# Altium schematic sheet OpenRex_V1I1 Project.SchDoc
size A3; DocumentNumber: 31; SheetNumber: 31; SheetTotal: 31; PageSetup: Record=PageOptions|CenterHorizontal=True|CenterVertical=True|PrintScale=1.07|XCorrection=1.00|YCorrection=1.00|PrintKind=1|BorderSize=5000000|LeftOffset=0|BottomOffset=0|Orientation=2|PaperLength=1000|PaperWidth=1000|Scale=100|PaperSource=7|PrintQuality=600|MediaType=1|DitherType=10|PaperKind=A3|PrintScaleMode=1
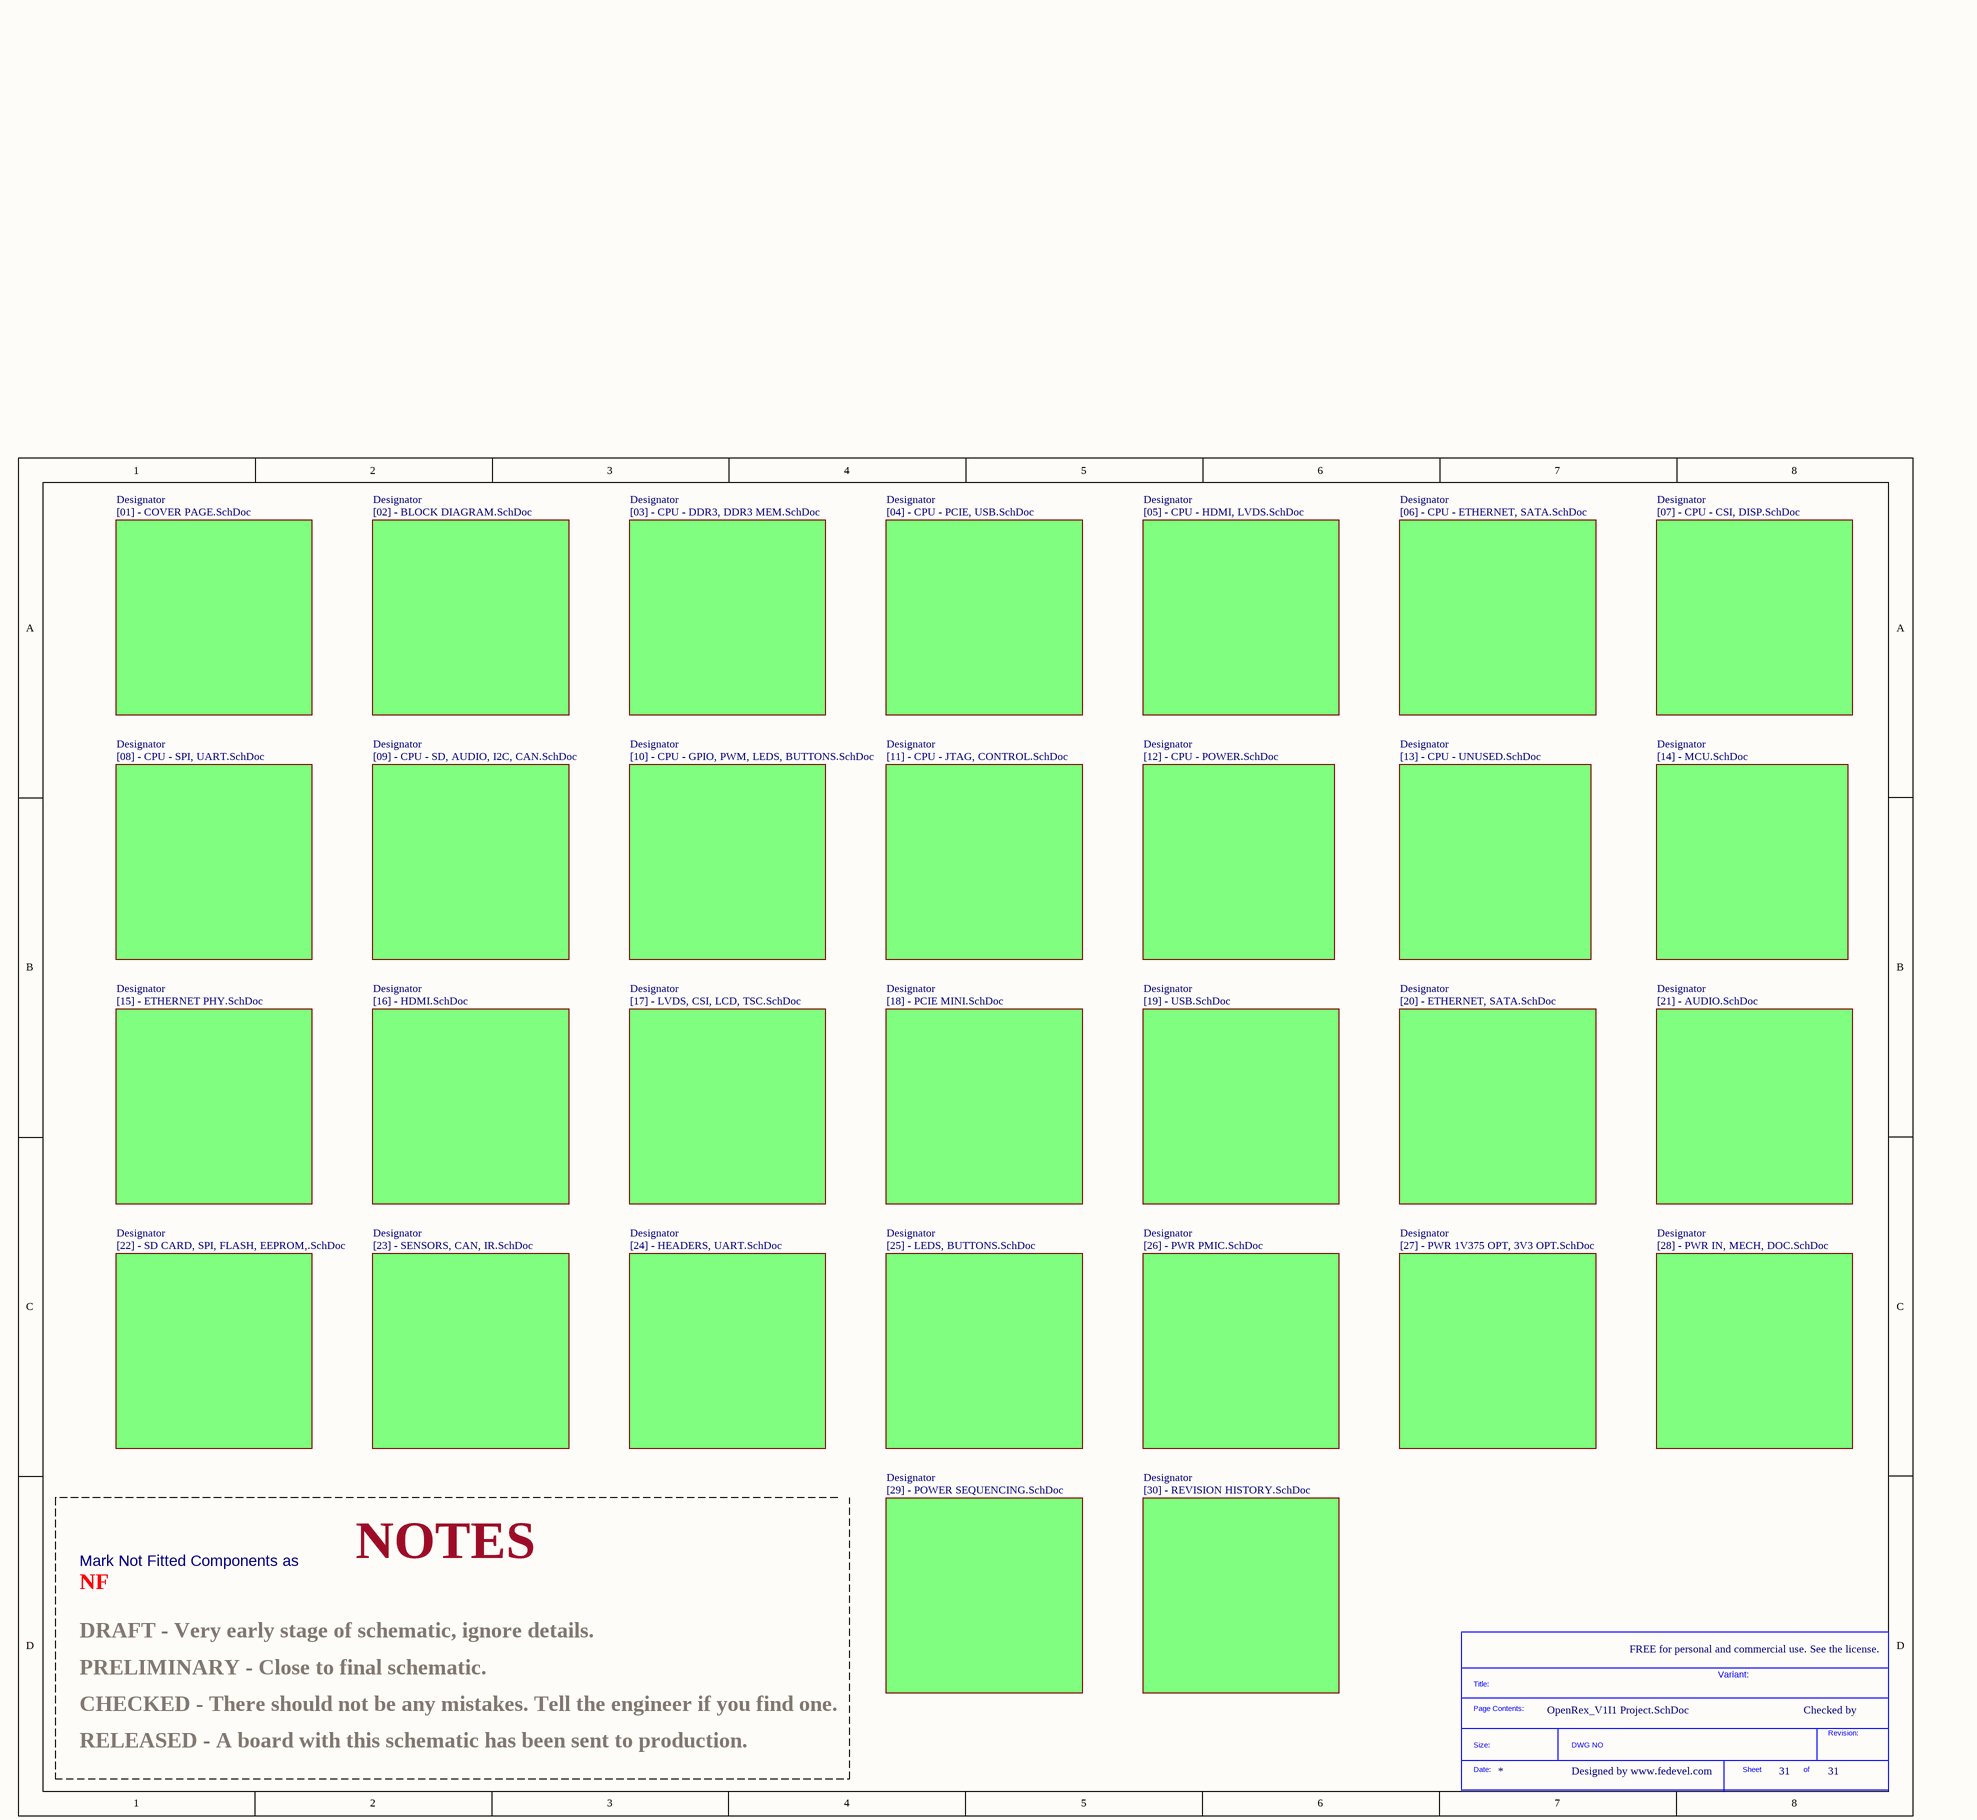
[diagram p0: OpenRex_V1I1 Project.SchDoc]

## Parts
*  SDTitleBlock  (value not drawn)  (graphical)

## Sub-sheets
Designator = [01] - COVER PAGE.SchDoc: no entries
Designator = [02] - BLOCK DIAGRAM.SchDoc: no entries
Designator = [17] - LVDS, CSI, LCD, TSC.SchDoc: no entries
Designator = [04] - CPU - PCIE, USB.SchDoc: no entries
Designator = [05] - CPU - HDMI, LVDS.SchDoc: no entries
Designator = [06] - CPU - ETHERNET, SATA.SchDoc: no entries
Designator = [08] - CPU - SPI, UART.SchDoc: no entries
Designator = [10] - CPU - GPIO, PWM, LEDS, BUTTONS.SchDoc: no entries
Designator = [09] - CPU - SD, AUDIO, I2C, CAN.SchDoc: no entries
Designator = [03] - CPU - DDR3, DDR3 MEM.SchDoc: no entries
Designator = [11] - CPU - JTAG, CONTROL.SchDoc: no entries
Designator = [12] - CPU - POWER.SchDoc: no entries
Designator = [18] - PCIE MINI.SchDoc: no entries
Designator = [13] - CPU - UNUSED.SchDoc: no entries
Designator = [15] - ETHERNET PHY.SchDoc: no entries
Designator = [19] - USB.SchDoc: no entries
Designator = [07] - CPU - CSI, DISP.SchDoc: no entries
Designator = [14] - MCU.SchDoc: no entries
Designator = [20] - ETHERNET, SATA.SchDoc: no entries
Designator = [25] - LEDS, BUTTONS.SchDoc: no entries
Designator = [26] - PWR PMIC.SchDoc: no entries
Designator = [27] - PWR 1V375 OPT, 3V3 OPT.SchDoc: no entries
Designator = [28] - PWR IN, MECH, DOC.SchDoc: no entries
Designator = [22] - SD CARD, SPI, FLASH, EEPROM,.SchDoc: no entries
Designator = [23] - SENSORS, CAN, IR.SchDoc: no entries
Designator = [30] - REVISION HISTORY.SchDoc: no entries
Designator = [16] - HDMI.SchDoc: no entries
Designator = [21] - AUDIO.SchDoc: no entries
Designator = [24] - HEADERS, UART.SchDoc: no entries
Designator = [29] - POWER SEQUENCING.SchDoc: no entries

## Notes on the sheet
- NF
- Mark Not Fitted Components as
- NOTES
- DRAFT - Very early stage of schematic, ignore details.
- FREE for personal and commercial use. See the license.
- PRELIMINARY - Close to final schematic.
- CHECKED - There should not be any mistakes. Tell the engineer if you find one.
- Variant:
- Checked by
- RELEASED - A board with this schematic has been sent to production.
- Designed by www.fedevel.com
- (in symbol SDTitleBlock) Title:; Page Contents:; Revision:; Size:; DWG NO; Date:; Sheet; of